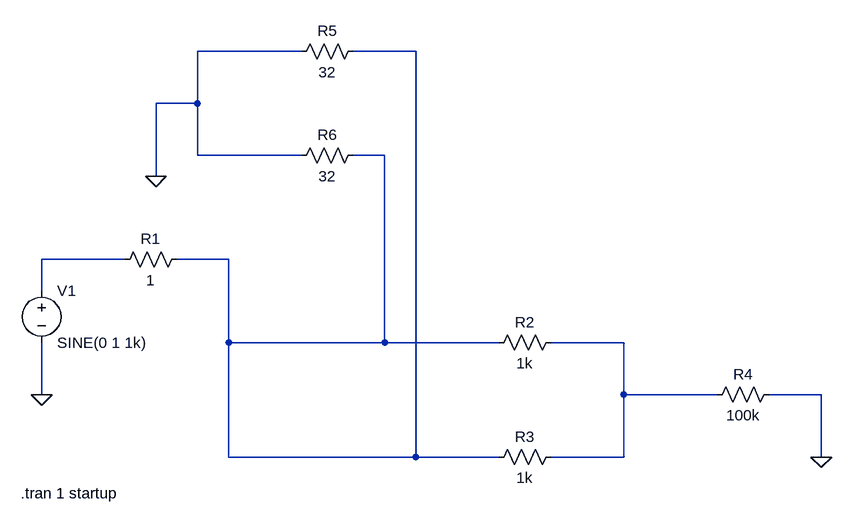
[diagram p0: schematic mixer_test.asc]
mixer_test.asc, the LTspice schematic file:
Version 4
SHEET 1 1252 680
WIRE 432 -256 272 -256
WIRE 608 -256 512 -256
WIRE 272 -176 272 -256
WIRE 272 -176 208 -176
WIRE 272 -96 272 -176
WIRE 432 -96 272 -96
WIRE 560 -96 512 -96
WIRE 208 -64 208 -176
WIRE 160 64 32 64
WIRE 320 64 240 64
WIRE 32 112 32 64
WIRE 320 192 320 64
WIRE 560 192 560 -96
WIRE 560 192 320 192
WIRE 736 192 560 192
WIRE 928 192 816 192
WIRE 32 272 32 192
WIRE 928 272 928 192
WIRE 1072 272 928 272
WIRE 1232 272 1152 272
WIRE 320 368 320 192
WIRE 608 368 608 -256
WIRE 608 368 320 368
WIRE 736 368 608 368
WIRE 928 368 928 272
WIRE 928 368 816 368
WIRE 1232 368 1232 272
FLAG 32 272 0
FLAG 1232 368 0
FLAG 208 -64 0
SYMBOL voltage 32 96 R0
WINDOW 123 0 0 Left 0
WINDOW 39 0 0 Left 0
SYMATTR InstName V1
SYMATTR Value SINE(0 1 1k)
SYMBOL res 256 48 R90
WINDOW 0 0 56 VBottom 2
WINDOW 3 32 56 VTop 2
SYMATTR InstName R1
SYMATTR Value 1
SYMBOL res 832 176 R90
WINDOW 0 0 56 VBottom 2
WINDOW 3 32 56 VTop 2
SYMATTR InstName R2
SYMATTR Value 1k
SYMBOL res 832 352 R90
WINDOW 0 0 56 VBottom 2
WINDOW 3 32 56 VTop 2
SYMATTR InstName R3
SYMATTR Value 1k
SYMBOL res 1168 256 R90
WINDOW 0 0 56 VBottom 2
WINDOW 3 32 56 VTop 2
SYMATTR InstName R4
SYMATTR Value 100k
SYMBOL res 528 -272 R90
WINDOW 0 0 56 VBottom 2
WINDOW 3 32 56 VTop 2
SYMATTR InstName R5
SYMATTR Value 32
SYMBOL res 528 -112 R90
WINDOW 0 0 56 VBottom 2
WINDOW 3 32 56 VTop 2
SYMATTR InstName R6
SYMATTR Value 32
TEXT 0 424 Left 2 !.tran 1 startup

The netlist it stands for:
* mixer_test.asc
V1 N002 0 SINE(0 1 1k)
R1 N001 N002 1
R2 N003 N001 1k
R3 N003 N001 1k
R4 0 N003 100k
R5 N001 0 32
R6 N001 0 32
.tran 1 startup
.backanno
.end